# EAGLE design mac_schematic_v11print (EAGLE 8.7.0)
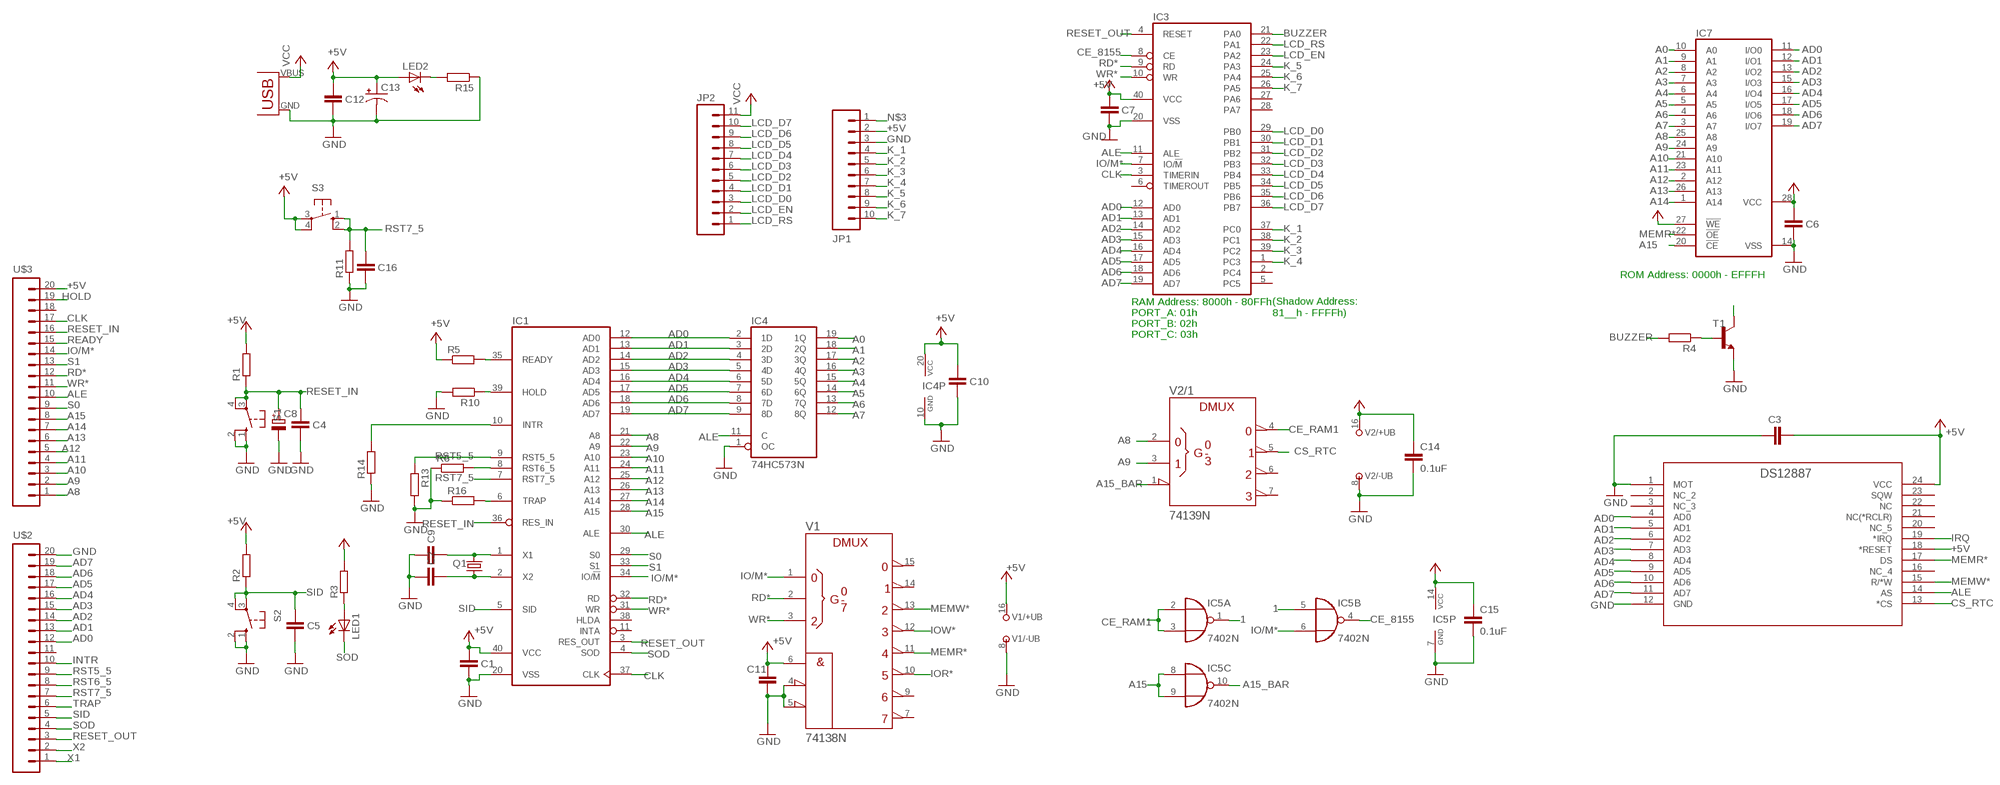
[diagram p0: schematic, sheet 1]

## Parts
C1  C-EUC0805K  [C0805K]
C2  C-EUC0805K  [C0805K]
C3  C-EUC0805K  [C0805K]
C4  C-EUC0805K  [C0805K]
C5  C-EUC0805K  [C0805K]
C6  C-EUC0805K  [C0805K]
C7  C-EUC0805K  [C0805K]
C8  CPOL-EUE2.5-5  [E2,5-5]
C9  C-EUC0805K  [C0805K]
C10  C-EUC0805K  [C0805K]
C11  C-EUC0805K  [C0805K]
C12  C-EUC0805K  [C0805K]
C13  CAP_POL_10V  [C/6032-28R]
C14  0.1uF  C-EUC0805K  [C0805K]
C15  0.1uF  C-EUC0805K  [C0805K]
C16  C-EUC0805K  [C0805K]
IC1  8085  [DIL40]
IC3  8155  [DIL40]
IC4  74HC573N  [DIL20]
IC5  7402N  [DIL14]
IC7  58C256P  [DIL28-6]
JP1  M10SILK_FEMALE_PTH  [1X10]
JP2  M11PTH  [1X11]
LED1  LED3MM  [LED3MM]
LED2  LED3MM  [LED3MM]
Q1  CRYSTALHC49U-V  [HC49U-V]
R1  R-EU_0204/7  [0204/7]
R2  R-EU_0204/7  [0204/7]
R3  R-EU_0204/7  [0204/7]
R4  R-EU_0204/7  [0204/7]
R5  R-EU_0204/7  [0204/7]
R6  R-EU_0204/7  [0204/7]
R10  R-EU_0204/7  [0204/7]
R11  R-EU_0204/7  [0204/7]
R13  R-EU_0204/7  [0204/7]
R14  R-EU_0204/7  [0204/7]
R15  R-EU_0204/7  [0204/7]
R16  R-EU_0204/7  [0204/7]
S1  40-XX  [B3F-40XX]
S2  40-XX  [B3F-40XX]
S3  40-XX  [B3F-40XX]
T1  BC547-NPN-TO92-CBE  [TO92-CBE]
U1  DS12887  [21-0241A_24]
U$1  USB(POWER)  [USB(POWER)]
U$2  M20  [LONDPAD]
U$3  M20  [LONDPAD]
V1  74138N  [DIL16]
V2  74139N  [DIL16]

## Nets
1: IC5.1(A:O) IC5.5(B:I0)
+5V: C1.1 C3.2 C6.1 C7.1 C10.1 C11.1 C12.1 C13.+ C14.1 C15.1 IC1.40(VCC) IC3.40(VCC) IC4.20(VCC) IC5.14(P:VCC) IC7.27(!WE) IC7.28(VCC) JP1.2 LED2.A R1.2 R2.2 R3.2 R5.1 S3.3(P) S3.4(P1) U1.18(*RESET) U1.24(VCC) U$3.20 V1.6(G1) V1.16(+UB) V2.16(/+UB:+UB) ; supply symbol labelled VCC
A0: IC4.19(1Q) IC7.10(A0)
A1: IC4.18(2Q) IC7.9(A1)
A2: IC4.17(3Q) IC7.8(A2)
A3: IC4.16(4Q) IC7.7(A3)
A4: IC4.15(5Q) IC7.6(A4)
A5: IC4.14(6Q) IC7.5(A5)
A6: IC4.13(7Q) IC7.4(A6)
A7: IC4.12(8Q) IC7.3(A7)
A8: IC1.21(A8) IC7.25(A8) U$3.1 V2.2(/1:A)
A9: IC1.22(A9) IC7.24(A9) U$3.2 V2.3(/1:B)
A10: IC1.23(A10) IC7.21(A10) U$3.3
A11: IC1.24(A11) IC7.23(A11) U$3.4
A12: IC1.25(A12) IC7.2(A12) U$3.5
A13: IC1.26(A13) IC7.26(A13) U$3.6
A14: IC1.27(A14) IC7.1(A14) U$3.7
A15: IC1.28(A15) IC5.8(C:I0) IC5.9(C:I1) IC7.20(!CE) U$3.8
A15_BAR: IC5.10(C:O) V2.1(/1:!G)
AD0: IC1.12(AD0) IC3.12(AD0) IC4.2(1D) IC7.11(I/O0) U1.4(AD0) U$2.12
AD1: IC1.13(AD1) IC3.13(AD1) IC4.3(2D) IC7.12(I/O1) U1.5(AD1) U$2.13
AD2: IC1.14(AD2) IC3.14(AD2) IC4.4(3D) IC7.13(I/O2) U1.6(AD2) U$2.14
AD3: IC1.15(AD3) IC3.15(AD3) IC4.5(4D) IC7.15(I/O3) U1.7(AD3) U$2.15
AD4: IC1.16(AD4) IC3.16(AD4) IC4.6(5D) IC7.16(I/O4) U1.8(AD4) U$2.16
AD5: IC1.17(AD5) IC3.17(AD5) IC4.7(6D) IC7.17(I/O5) U1.9(AD5) U$2.17
AD6: IC1.18(AD6) IC3.18(AD6) IC4.8(7D) IC7.18(I/O6) U1.10(AD6) U$2.18
AD7: IC1.19(AD7) IC3.19(AD7) IC4.9(8D) IC7.19(I/O7) U1.11(AD7) U$2.19
ALE: IC1.30(ALE) IC3.11(ALE) IC4.11(C) U1.14(AS) U$3.10
BUZZER: IC3.21(PA0) R4.2
CE_8155: IC3.8(CE) IC5.4(B:O)
CE_RAM1: IC5.2(A:I0) IC5.3(A:I1) V2.4(/1:Y0)
CLK: IC1.37(CLK) IC3.3(TIMERIN) U$3.17
CS_RTC: U1.13(*CS) V2.5(/1:Y1)
GND: C1.2 C2.1 C3.1 C4.2 C5.2 C6.2 C7.2 C8.- C9.1 C10.2 C11.2 C12.2 C13.- C14.2 C15.2 C16.2 IC1.20(VSS) IC3.20(VSS) IC4.1(OC) IC4.10(GND) IC5.7(P:GND) IC7.14(VSS) JP1.3 R6.1 R10.2 R11.1 R13.2 R14.1 R15.1 R16.1 S1.1(S) S1.2(S1) S2.1(S) S2.2(S1) T1.E U1.1(MOT) U1.12(GND) U$1.GND U$2.20 V1.4(!G2A) V1.5(!G2B) V1.8(-UB) V2.8(/-UB:-UB)
HOLD: IC1.39(HOLD) R10.1 U$3.19
INTR: IC1.10(INTR) R14.2 U$2.10
IO/M*: IC1.34(IO/!M) IC3.7(IO/!M) IC5.6(B:I1) U$3.14 V1.1(A)
IOR*: V1.10(Y5)
IOW*: V1.12(Y3)
IRQ: U1.19(*IRQ)
K_1: IC3.37(PC0) JP1.4
K_2: IC3.38(PC1) JP1.5
K_3: IC3.39(PC2) JP1.6
K_4: IC3.1(PC3) JP1.7
K_5: IC3.24(PA3) JP1.8
K_6: IC3.25(PA4) JP1.9
K_7: IC3.26(PA5) JP1.10
LCD_D0: IC3.29(PB0) JP2.3
LCD_D1: IC3.30(PB1) JP2.4
LCD_D2: IC3.31(PB2) JP2.5
LCD_D3: IC3.32(PB3) JP2.6
LCD_D4: IC3.33(PB4) JP2.7
LCD_D5: IC3.34(PB5) JP2.8
LCD_D6: IC3.35(PB6) JP2.9
LCD_D7: IC3.36(PB7) JP2.10
LCD_EN: IC3.23(PA2) JP2.2
LCD_RS: IC3.22(PA1) JP2.1
MEMR*: IC7.22(!OE) U1.17(DS) V1.11(Y4)
MEMW*: U1.15(R/*W) V1.13(Y2)
N$1: LED1.A R3.1
N$3: JP1.1 T1.C
N$4: R4.1 T1.B
N$10: LED2.K(C) R15.2
RD*: IC1.32(RD) IC3.9(RD) U$3.12 V1.2(B)
READY: IC1.35(READY) R5.2 U$3.15
RESET_IN: C4.1 C8.+ IC1.36(RES_IN) R1.1 S1.3(P) S1.4(P1) U$3.16
RESET_OUT: IC1.3(RES_OUT) IC3.4(RESET) U$2.3
RST5_5: IC1.9(RST5_5) R13.1 U$2.9
RST6_5: IC1.8(RST6_5) R6.2 U$2.8
RST7_5: C16.1 IC1.7(RST7_5) R11.2 S3.1(S) S3.2(S1) U$2.7
S0: IC1.29(S0) U$3.9
S1: IC1.33(S1) U$3.13
SID: C5.1 IC1.5(SID) R2.1 S2.3(P) S2.4(P1) U$2.5
SOD: IC1.4(SOD) LED1.K(C) U$2.4
TRAP: IC1.6(TRAP) R16.2 U$2.6
VCC: JP2.11 U$1.VBUS(VCC)
WR*: IC1.31(WR) IC3.10(WR) U$3.11 V1.3(C)
X1: C9.2 IC1.1(X1) Q1.2 U$2.1
X2: C2.2 IC1.2(X2) Q1.1 U$2.2
Unconnected: IC1.11(INTA) IC1.38(HLDA) IC3.2(PC4) IC3.5(PC5) IC3.6(TIMEROUT) IC3.27(PA6) IC3.28(PA7) IC5.11(D:I0) IC5.12(D:I1) IC5.13(D:O) U1.2(NC_2) U1.3(NC_3) U1.16(NC_4) U1.20(NC_5) U1.21(NC(*RCLR)) U1.22(NC) U1.23(SQW) U$2.11 U$3.18 V1.7(Y7) V1.9(Y6) V1.14(Y1) V1.15(Y0) V2.6(/1:Y2) V2.7(/1:Y3) V2.9(/2:Y3) V2.10(/2:Y2) V2.11(/2:Y1) V2.12(/2:Y0) V2.13(/2:B) V2.14(/2:A) V2.15(/2:!G)

## Notes on the sheet
- ROM Address: 0000h - EFFFH
- RAM Address: 8000h - 80FFh
- PORT_A: 01h
- (Shadow Address: 
  81__h - FFFFh)
- PORT_B: 02h
- PORT_C: 03h

## Library data of the parts
C1-C7 C9 C16 = rcl:C-EU: CAPACITOR, European symbol; SPICEPREFIX: C
C8 = rcl:CPOL-EU: POLARIZED CAPACITOR, European symbol
C10-C12 C14 C15 = resistor:C-EU: CAPACITOR, European symbol
C13 = CEDT_JANUARY_2015_v7:CAP_POL
IC1 = micro-intel:8085: MICROCOMPUTER/PERIPHERAL DEVICE; OC_FARNELL: unknown; OC_NEWARK: unknown
IC3 = micro-intel:8155: MICROCOMPUTER/PERIPHERAL DEVICE; OC_FARNELL: unknown; OC_NEWARK: unknown
IC4 = 74xx-eu:74*573: 8-bit D latch BUS DRIVER
IC5 = 74xx-eu:74*02: Quad 2-input NOR gate
IC7 = memory-hitachi:58C256P: MEMORY; MPN: HN58C256AP85E; OC_FARNELL: 1496447; OC_NEWARK: 61M6616
JP1 = SparkFun-Connectors:M10: Header 10 Standard 10-pin 0.1" header. Use with straight break away headers (SKU : PRT-00116), right angle break away headers (PRT-00553), swiss pins (PRT-00743), machine pins (PRT-00117), and female headers (PRT-00115).; PROD_ID: CONN-11563
JP2 = SparkFun-Connectors:M11: Header 11 Standard 11-pin 0.1" header. Use with straight break away headers (SKU : PRT-00116), right angle break away headers (PRT-00553), swiss pins (PRT-00743), machine pins (PRT-00117), and female headers (PRT-00115).
LED1 LED2 = led:LED: LED OSRAM: - CHIPLED LG R971, LG N971, LY N971, LG Q971, LY Q971, LO R971, LY R971 LH N974, LH R974 LS Q976, LO Q976, LY Q976 LO Q996 - Hyper CHIPLED LW Q18S LB Q993, LB Q99A, LB R99A - SideLED LS A670, LO A670, LY A670, LG A670, LP A670 LB A673, LV A673, LT A673, LW A673 LH A674 LY A675 LS A676, LA A676, LO A676, LY A676, LW A676 LS A679, LY A679, LG A679 - Hyper Micro SIDELED® LS Y876, LA Y876, LO Y876, LY Y876 LT Y87S - SmartLED LW L88C, LW L88S LB L89C, LB L89S, LG L890 LS L89K, LO L89K, LY L89K LS L896, LA L896, LO L896, LY L896 - TOPLED LS T670, LO T670, LY T670, LG T670, LP T670 LSG T670, LSP T670, LSY T670, LOP T670, LYG T670 LG T671, LOG T671, LSG T671 LB T673, LV T673, LT T673, LW T673 LH T674 LS T676, LA T676, LO T676, LY T676, LB T676, LH T676, LSB T676, LW T676 LB T67C, LV T67C, LT T67C, LS T67K, LO T67K, LY T67K, LW E67C LS E67B, LA E67B, LO E67B, LY E67B, LB E67C, LV E67C, LT E67C LW T67C LS T679, LY T679, LG T679 LS T770, LO T770, LY T770, LG T770, LP T770 LB T773, LV T773, LT T773, LW T773 LH T774 LS E675, LA E675, LY E675, LS T675 LS T776, LA T776, LO T776, LY T776, LB T776 LHGB T686 LT T68C, LB T68C - Hyper Mini TOPLED® LB M676 - Mini TOPLED Santana® LG M470 LS M47K, LO M47K, LY M47K Source: http://www.osram.convergy.de LUXEON: - LUMILED® LXK2-PW12-R00, LXK2-PW12-S00, LXK2-PW14-U00, LXK2-PW14-V00 LXK2-PM12-R00, LXK2-PM12-S00, LXK2-PM14-U00 LXK2-PE12-Q00, LXK2-PE12-R00, LXK2-PE12-S00, LXK2-PE14-T00, LXK2-PE14-U00 LXK2-PB12-K00, LXK2-PB12-L00, LXK2-PB12-M00, LXK2-PB14-N00, LXK2-PB14-P00, LXK2-PB14-Q00 LXK2-PR12-L00, LXK2-PR12-M00, LXK2-PR14-Q00, LXK2-PR14-R00 LXK2-PD12-Q00, LXK2-PD12-R00, LXK2-PD12-S00 LXK2-PH12-R00, LXK2-PH12-S00 LXK2-PL12-P00, LXK2-PL12-Q00, LXK2-PL12-R00 Source: www.luxeon.com KINGBRIGHT: KA-3528ASYC Source: www.kingbright.com
Q1 = crystal:CRYSTAL: CRYSTAL; OC_FARNELL: 1666969; OC_NEWARK: unknown
R1-R6 R10 R11 R13-R16 = rcl:R-EU_: RESISTOR, European symbol; SPICEPREFIX: R
S1-S3 = switch-omron:40-XX: OMRON SWITCH; MF: OMRON COMPONENTS USA; MPN: B3F-4000; OC_FARNELL: 176434; OC_NEWARK: 36K3105
T1 = transistor:*-NPN-: NPN Transistror BF959 corrected 2008.03.06
U1 = DS12887:DS12887; AVAILABILITY: Unavailable; DESCRIPTION: IC RTC CLK/CALENDAR PAR 24-EDIP; MF: Maxim Integrated; MP: DS12887; PACKAGE: DIP-24 Maxim Integrated; PRICE: 7.29 USD
U$1 = CEDT_JANUARY_2015_v7:USB(POWER)
U$2 U$3 = m20:M20
V1 = 74ttl-din:74*138: 3-line to 8-line DECODER/DEMULTIPLEXER
V2 = 74ttl-din:74*139: Dual 2-line to 4-line DECODER/DEMULTIPLEXER

## Net classes
2 GND: width 0.406 mm, clearance 0.203 mm

## Board
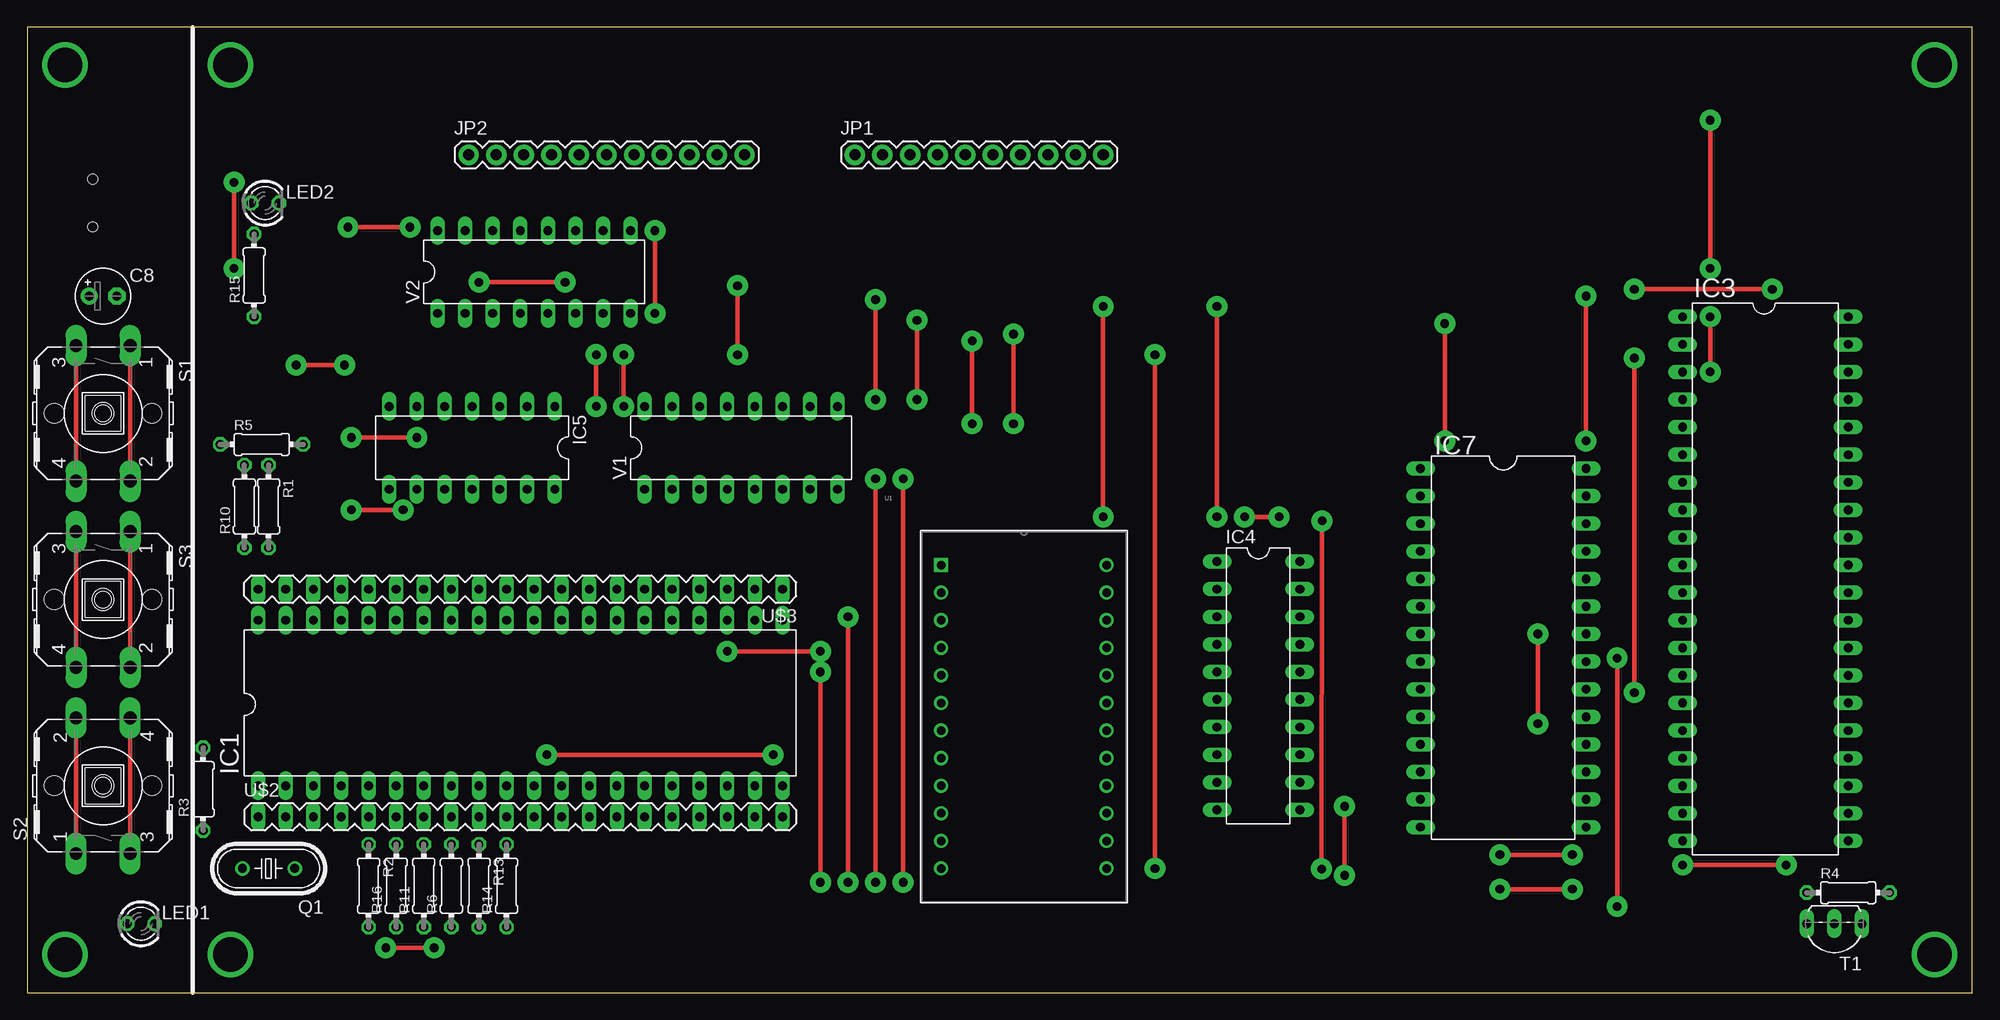
[diagram p1: board, top side]
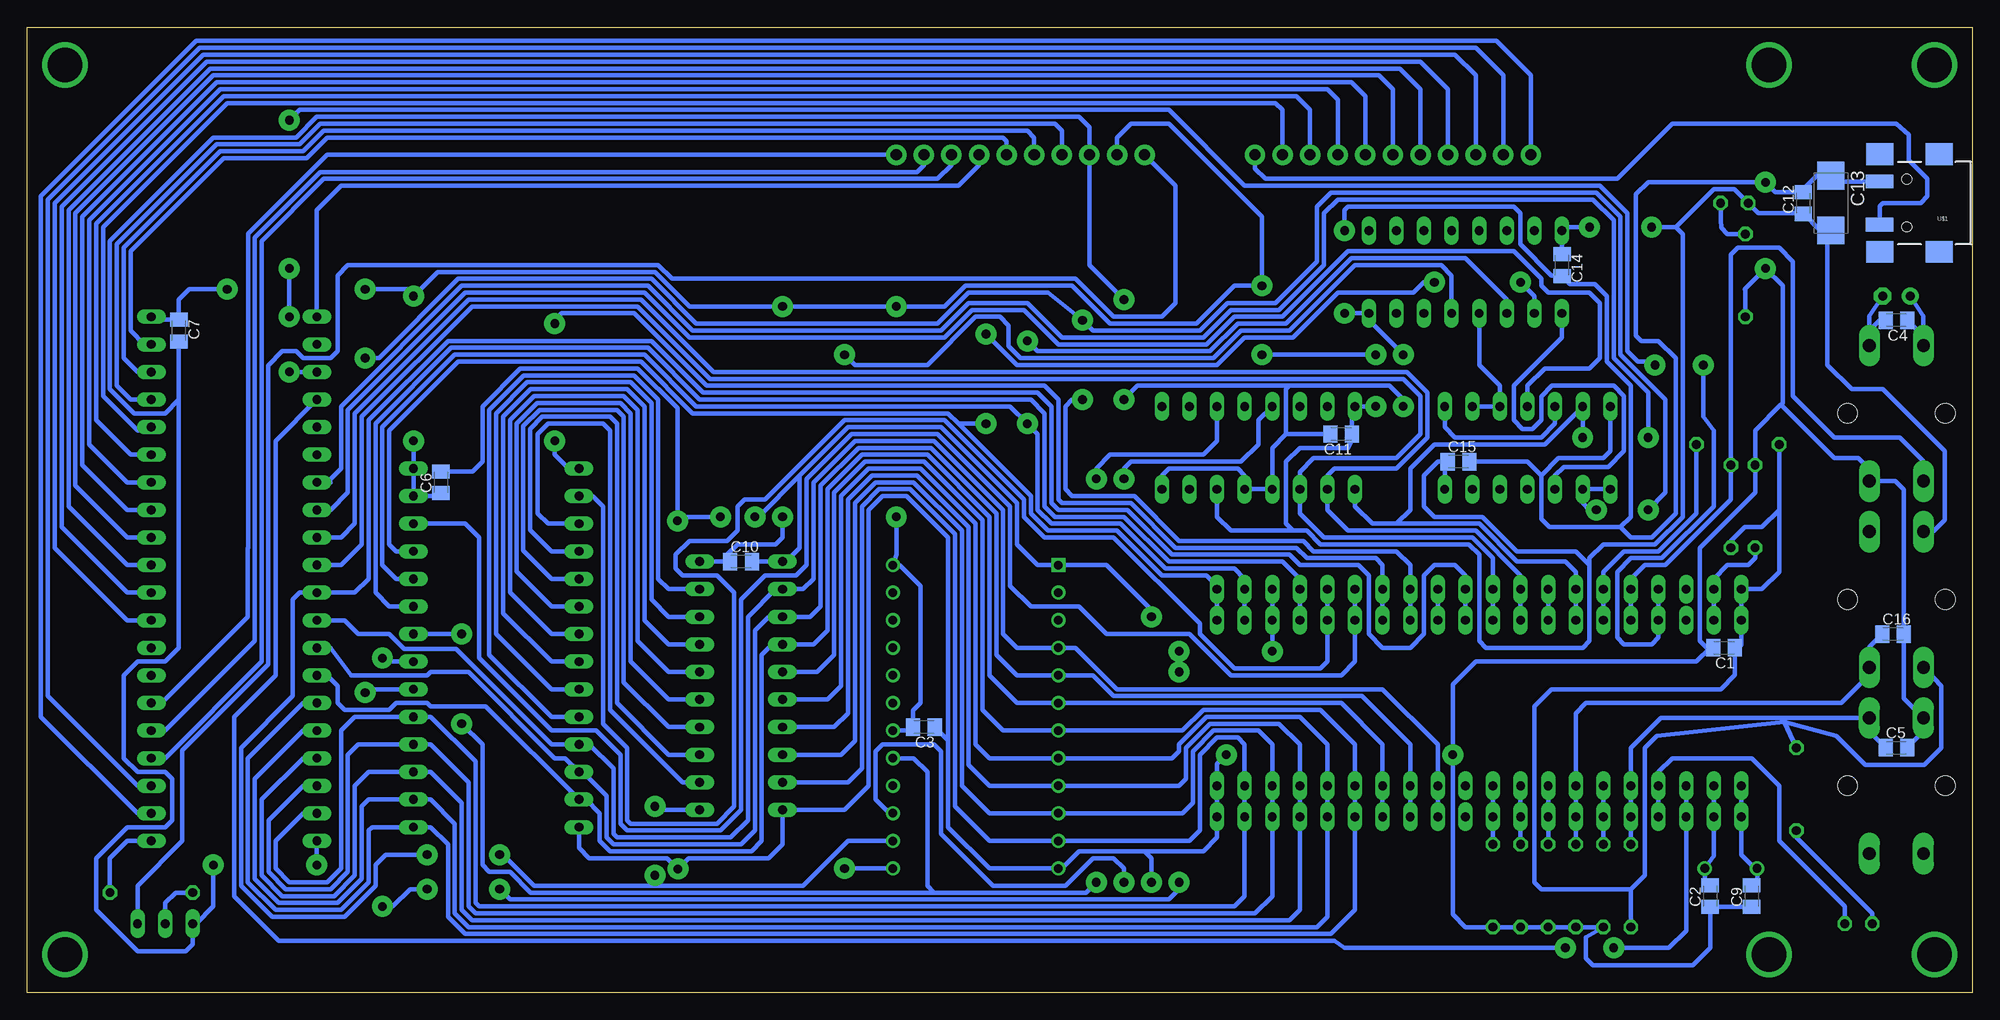
[diagram p2: board, bottom side, seen from below]

Size 179.07 x 88.9 mm. Coordinates in mm from the lower left corner, seen from the top.
Outline: 0,0 179.07,0 179.07,88.9 0,88.9 0,0
Copper layers (1*16): Top 0.035mm / dielectric 1.5mm / Bottom 0.035mm
Design rules "drcsetting *": minimum track width 16mil, minimum drill 25mil, track to track 8mil, track to pad 8mil, pad to pad 8mil, via to via 8mil, smd to smd 8mil, copper to edge 40mil, drill to drill 12mil, minimum pad ring 10mil, minimum via ring 10mil, stop-mask expansion 4mil, vias tented up to drill 0mil, thermal gap 10mil

### Footprints (pad centres in the part's own frame; a part is rotated, then mirrored left to right if it is on the bottom)
C0805K = smd 1.3 x 1.6: 1 -1,0; 2 1,0
E2,5-5 = drill 0.813 pad 1.6: + -1.27,0 | drill 0.813 pad 1.6 octagon: - 1.27,0
C/6032-28R = smd 2.55 x 2.5: + 2.525,0; - -2.525,0
DIL40 = drill 0.813 long: 1 -24.13,-7.62; 2 -21.59,-7.62; 3 -19.05,-7.62; 4 -16.51,-7.62; 5 -13.97,-7.62; 6 -11.43,-7.62; 7 -8.89,-7.62; 8 -6.35,-7.62; 9 -3.81,-7.62; 10 -1.27,-7.62; 11 1.27,-7.62; 12 3.81,-7.62; 13 6.35,-7.62; 14 8.89,-7.62; 15 11.43,-7.62; 16 13.97,-7.62; 17 16.51,-7.62; 18 19.05,-7.62; 19 21.59,-7.62; 20 24.13,-7.62; 21 24.13,7.62; 22 21.59,7.62; 23 19.05,7.62; 24 16.51,7.62; 25 13.97,7.62; 26 11.43,7.62; 27 8.89,7.62; 28 6.35,7.62; 29 3.81,7.62; 30 1.27,7.62; 31 -1.27,7.62; 32 -3.81,7.62; 33 -6.35,7.62; 34 -8.89,7.62; 35 -11.43,7.62; 36 -13.97,7.62; 37 -16.51,7.62; 38 -19.05,7.62; 39 -21.59,7.62; 40 -24.13,7.62
DIL20 = drill 0.813 long: 1 -11.43,-3.81; 2 -8.89,-3.81; 3 -6.35,-3.81; 4 -3.81,-3.81; 5 -1.27,-3.81; 6 1.27,-3.81; 7 3.81,-3.81; 8 6.35,-3.81; 9 8.89,-3.81; 10 11.43,-3.81; 11 11.43,3.81; 12 8.89,3.81; 13 6.35,3.81; 14 3.81,3.81; 15 1.27,3.81; 16 -1.27,3.81; 17 -3.81,3.81; 18 -6.35,3.81; 19 -8.89,3.81; 20 -11.43,3.81
DIL14 = drill 0.813 long: 1 -7.62,-3.81; 2 -5.08,-3.81; 3 -2.54,-3.81; 4 0,-3.81; 5 2.54,-3.81; 6 5.08,-3.81; 7 7.62,-3.81; 8 7.62,3.81; 9 5.08,3.81; 10 2.54,3.81; 11 0,3.81; 12 -2.54,3.81; 13 -5.08,3.81; 14 -7.62,3.81
DIL28-6 = drill 0.813 long: 1 -16.51,-7.62; 2 -13.97,-7.62; 3 -11.43,-7.62; 4 -8.89,-7.62; 5 -6.35,-7.62; 6 -3.81,-7.62; 7 -1.27,-7.62; 8 1.27,-7.62; 9 3.81,-7.62; 10 6.35,-7.62; 11 8.89,-7.62; 12 11.43,-7.62; 13 13.97,-7.62; 14 16.51,-7.62; 15 16.51,7.62; 16 13.97,7.62; 17 11.43,7.62; 18 8.89,7.62; 19 6.35,7.62; 20 3.81,7.62; 21 1.27,7.62; 22 -1.27,7.62; 23 -3.81,7.62; 24 -6.35,7.62; 25 -8.89,7.62; 26 -11.43,7.62; 27 -13.97,7.62; 28 -16.51,7.62
1X10 = drill 1.016 pad 1.88: 1 0,0; 2 2.54,0; 3 5.08,0; 4 7.62,0; 5 10.16,0; 6 12.7,0; 7 15.24,0; 8 17.78,0; 9 20.32,0; 10 22.86,0
1X11 = drill 1.016 pad 1.88: 1 0,0; 2 2.54,0; 3 5.08,0; 4 7.62,0; 5 10.16,0; 6 12.7,0; 7 15.24,0; 8 17.78,0; 9 20.32,0; 10 22.86,0; 11 25.4,0
LED3MM = drill 0.813 octagon: A -1.27,0; K 1.27,0
HC49U-V = drill 0.813: 1 -2.413,0; 2 2.413,0
0204/7 = drill 0.813 octagon: 1 -3.81,0; 2 3.81,0
B3F-40XX = drill 1.194 long: 1 -6.248,2.489; 2 6.248,2.489; 3 -6.248,-2.489; 4 6.248,-2.489 | hole 1.803: 0,-4.496; 0,4.496
TO92-CBE = drill 0.813 long: B 0,0; C -2.54,0; E 2.54,0
21-0241A_24 = drill 0.787 pad 1.295 square: 1 -15.24,27.94 | drill 0.787 pad 1.295: 2 -15.24,25.4; 3 -15.24,22.86; 4 -15.24,20.32; 5 -15.24,17.78; 6 -15.24,15.24; 7 -15.24,12.7; 8 -15.24,10.16; 9 -15.24,7.62; 10 -15.24,5.08; 11 -15.24,2.54; 12 -15.24,0; 13 0,0; 14 0,2.54; 15 0,5.08; 16 0,7.62; 17 0,10.16; 18 0,12.7; 19 0,15.24; 20 0,17.78; 21 0,20.32; 22 0,22.86; 23 0,25.4; 24 0,27.94
USB(POWER) = smd 2.54 x 1.27: GND 2.5,-1.981; VBUS 2.5,1.981 | smd 2.5 x 2: GND@1 -3,-4.5; GND@2 -3,4.5; GND@3 2.5,4.5; GND@4 2.5,-4.5 | hole 0.9: 0,2.2; 0,-2.2
LONDPAD = drill 0.813 long: 1 1.27,3.81; 2 3.81,3.81; 3 6.35,3.81; 4 8.89,3.81; 5 11.43,3.81; 6 13.97,3.81; 7 16.51,3.81; 8 19.05,3.81; 9 21.59,3.81; 10 24.13,3.81; 11 26.67,3.81; 12 29.21,3.81; 13 31.75,3.81; 14 34.29,3.81; 15 36.83,3.81; 16 39.37,3.81; 17 41.91,3.81; 18 44.45,3.81; 19 46.99,3.81; 20 49.53,3.81
DIL16 = drill 0.813 long: 1 -8.89,-3.81; 2 -6.35,-3.81; 3 -3.81,-3.81; 4 -1.27,-3.81; 5 1.27,-3.81; 6 3.81,-3.81; 7 6.35,-3.81; 8 8.89,-3.81; 9 8.89,3.81; 10 6.35,3.81; 11 3.81,3.81; 12 1.27,3.81; 13 -1.27,3.81; 14 -3.81,3.81; 15 -6.35,3.81; 16 -8.89,3.81

### Placement (x,y rotation side)
C1  22.86,31.75 180 bottom
C2  24.13,8.89 90 bottom
C3  96.52,24.45 180 bottom
C4  6.99,61.91 180 bottom
C5  6.99,22.54 0 bottom
C6  140.97,46.99 90 bottom
C7  165.1,60.96 270 bottom
C8  6.99,64.14 0 top
C9  20.32,8.89 90 bottom
C10  113.35,39.69 0 bottom
C11  58.1,51.44 180 bottom
C12  15.56,72.71 90 bottom
C13  13.02,72.71 270 bottom
C14  37.78,66.99 270 bottom
C15  47.31,48.9 0 bottom
C16  7.3,33.02 0 bottom
IC1  45.4,26.67 0 top
IC3  160.02,38.1 270 top
IC4  113.35,28.26 270 top
IC5  40.96,50.16 180 top
IC7  135.89,31.75 270 top
JP1  76.2,77.15 0 top
JP2  40.64,77.15 0 top
LED1  10.48,6.35 0 top
LED2  21.91,72.71 0 top
Q1  22.23,11.43 180 top
R1  22.23,44.77 270 top
R2  31.43,9.84 270 top
R3  16.19,18.73 90 top
R4  167.64,9.21 0 top
R5  21.59,50.48 0 top
R6  39.05,9.84 90 top
R10  20,44.77 90 top
R11  36.51,9.84 90 top
R13  41.59,9.84 270 top
R14  44.13,9.84 90 top
R15  20.89,66.04 90 top
R16  33.97,9.84 90 top
S1  6.99,53.34 270 top
S2  6.99,19.05 90 top
S3  6.99,36.2 270 top
T1  166.37,6.35 180 top
U1  99.38,11.43 0 top
U$1  6.03,72.71 180 bottom
U$2  20,12.38 0 top
U$3  70.8,40.96 180 top
V1  65.72,50.16 0 top
V2  46.67,66.36 0 top

### Tracks (layer width: path | path; a pad name or v marks a point on that pad's centre or on a via)
1
  Bottom 0.406: IC5.5 38.42,52.39 39.69,51.12 47.62,51.12 48.58,52.07 IC5.1
+5V  (via drill 0.8 pad 1.93)
  Top 0.406: v99.06,43.81 v99.06,63.18 | v54.93,58.74 v54.93,53.98 | v29.53,70.48 v35.24,70.48 | S3.4 S3.3 | v143.51,50.8 v143.51,64.14 | v147.96,64.77 v160.66,64.77 | v109.54,43.81 v109.54,63.18 | v65.41,58.74 v65.41,65.09
  Bottom 0.406: 12.47,70.73 C13.+ | IC4.20 C10.1 114.62,39.96 114.62,40.32 113.67,41.27 110.17,41.27 109.54,41.91 v109.54,43.81 | 21.27,37.1 IC1.40 | 15.56,71.75 C12.1 | 15.56,71.75 19.68,71.75 LED2.A 21.91,73.98 23.81,73.98 27.3,70.48 | C13.+ 13.98,70.18 15.56,71.75 | IC1.40 U$3.20 19.37,37.15 17.78,38.73 17.78,44.45 | C15.1 48.58,48.62 IC5.14 | 37.78,67.9 C14.1 V2.16 | C13.+ 13.34,69.86 13.34,57.78 11.11,55.56 8.26,55.56 2.54,49.85 2.54,43.5 3.59,42.44 S3.3 | 37.94,70.17 V2.16 | 4.45,30 S3.4 3.17,28.63 3.17,28.57 2.86,28.26 2.86,22.54 4.45,20.95 9.84,20.95 12.54,23.65 17.3,24.92 | 48.74,48.74 C15.1 | v99.06,43.81 99.06,40.32 U1.24 98.74,39.37 96.84,37.47 96.84,26.67 97.52,25.99 C3.2 97.84,24.13 U1.18 | IC3.40 167.37,61.96 C7.1 165.1,63.82 164.15,64.77 v160.66,64.77 | 48.26,48.9 C15.1 | 35.24,39.37 36.51,40.64 41.91,40.64 45.09,43.81 49.53,43.81 50.48,44.77 50.48,47.62 49.21,48.9 C15.1 | 35.24,39.37 35.24,32.38 35.88,31.75 44.77,31.75 45.4,32.38 45.4,40.32 46.35,41.27 60.01,41.27 61.28,42.55 62.55,42.55 | 21.86,31.16 21.86,31.43 | 21.86,31.43 C1.1 21.86,29.26 23.18,27.94 38.73,27.94 40.32,26.35 40.32,10.16 39.69,9.53 31.43,9.53 | 21.86,31.43 21.27,32.02 IC1.40 | V1.6 69.53,43.81 68.26,42.55 62.55,42.55 | 62.55,42.55 63.18,43.18 63.18,48.9 61.91,50.16 57.47,50.16 57.15,50.8 57.1,51.07 C11.1 57.1,53.7 V1.16 v54.93,53.98 | 35.24,39.37 35.24,40.01 33.97,41.27 29.21,41.27 26.67,43.81 26.67,69.85 27.3,70.48 | v35.24,70.48 37.47,70.48 V2.16 | C6.1 141.24,45.72 IC7.27 IC7.28 v143.51,50.8 | 28.57,70.48 v29.53,70.48 27.3,70.48 | R5.1 17.78,44.45 | R1.2 22.23,41.59 20.95,42.86 19.37,42.86 17.78,44.45
  Bottom 0.406: v54.93,58.74 v65.41,58.74 | JP1.2 78.74,78.74 77.47,80.01 73.98,80.01 65.41,71.44 v65.41,65.09 67.94,65.09 71.44,61.59 79.38,61.59 82.87,65.09 92.71,65.09 94.61,63.18 v99.06,63.18 v109.54,63.18 118.11,63.18 121.28,66.36 141.29,66.36 v143.51,64.14 144.15,64.77 v147.96,64.77 | 31.43,9.53 R2.2 | 17.3,24.92 29.05,23.65 30.16,22.54 30.16,10.79 31.43,9.53 | R3.2 17.3,24.92
A0
  Bottom 0.406: IC7.10 130.81,25.4 136.53,31.11 136.53,53.66 133.35,56.83 123.19,56.83 120.97,54.61 120.97,38.1 120.02,37.15 IC4.19
A1
  Bottom 0.406: IC7.9 130.81,27.94 135.89,33.02 135.89,53.34 133.03,56.2 123.51,56.2 121.6,54.29 121.6,36.2 120.02,34.61 IC4.18
A2
  Bottom 0.406: IC7.8 130.81,30.48 135.25,34.92 135.25,53.02 132.72,55.56 123.83,55.56 122.24,53.98 122.24,34.29 120.02,32.07 IC4.17
A3
  Bottom 0.406: IC7.7 130.81,33.02 134.62,36.83 134.62,52.7 132.4,54.93 124.14,54.93 122.87,53.66 122.87,32.38 120.02,29.53 IC4.16
A4
  Bottom 0.406: IC7.6 130.81,35.56 134.01,38.76 134.01,52.41 132.13,54.29 124.46,54.29 123.51,53.34 123.51,30.48 120.02,26.99 IC4.15
A5
  Bottom 0.406: IC7.5 130.81,38.1 133.4,40.69 133.4,52.16 131.9,53.66 124.78,53.66 124.14,53.02 124.14,28.57 120.02,24.45 IC4.14
A6
  Bottom 0.406: IC7.4 130.81,40.64 132.79,42.62 132.79,51.9 131.67,53.02 125.41,53.02 124.78,52.39 124.78,26.67 120.02,21.91 IC4.13
A7
  Bottom 0.406: IC4.12 118.75,19.37 125.41,26.04 125.41,51.75 126.05,52.39 131.13,52.39 132.08,51.44 132.08,44.13 131.13,43.18 IC7.3
A8  (via drill 0.8 pad 1.93)
  Top 0.406: v41.59,65.41 v49.53,65.41 | v90.81,60.64 v90.81,52.39
  Bottom 0.406: IC1.21 U$3.1 69.53,37.47 70.48,38.42 74.61,38.42 78.74,42.55 85.09,42.55 86.68,44.13 86.68,45.72 93.34,52.39 | V2.2 40.32,64.14 v41.59,65.41 | v49.53,65.41 50.48,65.41 51.44,64.45 58.42,64.45 62.55,60.33 66.99,60.33 69.53,57.78 87.95,57.78 v90.81,60.64 | IC7.25 145.1,40.64 145.73,41.27 145.73,51.75 139.38,58.1 122.56,58.1 117.79,53.34 94.3,53.34 93.34,52.39 | v90.81,52.39 93.34,52.39
A9  (via drill 0.8 pad 1.93)
  Top 0.406: v87,60.01 v87,52.39
  Bottom 0.406: IC1.22 U$3.2 66.99,38.1 67.94,39.05 74.3,39.05 78.42,43.18 84.77,43.18 86.04,44.45 86.04,51.44 v87,52.39 88.58,53.98 117.47,53.98 122.24,58.74 139.7,58.74 146.37,52.07 146.37,39.37 145.1,38.1 IC7.24 | V2.3 42.86,63.82 46.67,67.63 57.15,67.63 63.18,61.59 67.63,61.59 70.17,59.05 86.04,59.05 v87,60.01
A10  (via drill 0.8 pad 1.93)
  Top 0.406: v64.45,31.43 v73.03,31.43 | v73.03,29.53 v73.03,10.16 | v135.57,9.53 v142.24,9.53 | v146.37,7.94 v146.37,30.8
  Bottom 0.406: U$3.3 IC1.23 v64.45,31.43 | v73.03,31.43 v73.03,29.53 | v73.03,10.16 73.03,9.53 73.98,8.57 134.62,8.57 v135.57,9.53 | v142.24,9.53 143.83,9.53 145.41,7.94 v146.37,7.94 | IC7.21 145.73,30.48 v146.37,30.8
A11
  Bottom 0.406: IC7.23 145.73,35.56 147,36.83 147,52.39 140.02,59.37 121.92,59.37 117.16,54.61 86.68,54.61 85.41,53.34 85.41,44.77 84.45,43.81 78.11,43.81 73.98,39.69 63.5,39.69 61.91,38.1 U$3.4 IC1.24
A12
  Bottom 0.406: U$3.5 IC1.25 59.37,30.48 60.01,29.84 67.94,29.84 71.12,33.02 71.12,33.97 79.06,41.91 85.41,41.91 87.31,43.81 87.31,45.4 94.61,52.7 103.82,52.7 111.12,45.4 113.03,45.4 113.67,44.77 113.67,42.55 114.62,41.59 118.11,41.59 119.38,40.32 119.38,39.05 118.75,38.42 115.57,38.42 113.98,36.83 113.98,17.14 115.57,15.56 123.51,15.56 123.83,15.88 123.83,22.54 126.05,24.77 126.05,44.77 127,45.72 IC7.2
A13
  Bottom 0.406: U$3.6 IC1.26 56.83,30.48 58.1,29.21 68.26,29.21 72.07,33.02 79.69,33.02 82.23,35.56 86.68,35.56 88.58,37.47 88.58,44.77 95.25,51.44 103.19,51.44 107.31,47.31 107.31,39.37 108.27,38.42 111.12,38.42 113.35,36.2 113.35,16.83 115.25,14.92 123.83,14.92 124.46,15.56 124.46,21.91 126.68,24.13 130.81,24.13 137.48,30.8 137.48,41.91 138.75,43.18 IC7.26
A14  (via drill 0.8 pad 1.93)
  Top 0.406: v130.49,61.59 v130.49,50.8
  Bottom 0.406: IC1.27 U$3.7 54.29,39.37 54.93,40.01 61.28,40.01 62.23,40.96 73.34,40.96 77.47,45.09 83.82,45.09 84.14,45.4 84.14,54.61 85.41,55.88 116.52,55.88 123.19,62.55 129.86,62.55 130.49,61.91 v130.49,61.59 | IC7.1 129.22,48.26 130.49,49.53 v130.49,50.8
A15  (via drill 0.8 pad 1.93)
  Top 0.406: v34.61,44.45 v29.84,44.45 | v81.92,61.91 v81.92,54.61 | v147.96,58.42 v147.96,27.62
  Bottom 0.406: IC5.8 IC5.9 35.88,45.09 35.24,44.45 v34.61,44.45 | IC1.28 U$3.8 51.75,39.37 53.02,40.64 60.64,40.64 61.59,41.59 73.03,41.59 77.15,45.72 82.87,45.72 83.5,46.35 83.5,53.98 82.87,54.61 v81.92,54.61 | v29.84,44.45 28.26,46.04 28.26,54.61 32.38,58.74 32.38,71.44 34.61,73.66 59.05,73.66 60.33,72.39 60.33,67.31 64.14,63.5 68.58,63.5 71.12,60.96 80.96,60.96 v81.92,61.91 85.09,64.45 92.39,64.45 95.25,61.59 117.47,61.59 121.6,65.72 139.38,65.72 146.69,58.42 v147.96,58.42 | 143.83,27.94 IC7.20 147.64,27.94 v147.96,27.62
A15_BAR
  Bottom 0.406: IC5.10 38.42,47.62 37.62,48.42 33.5,48.42 32.07,49.85 32.07,54.93 33.02,55.88 38.7,55.88 39.69,54.89 39.69,52.7 40.48,51.91 41.43,51.91 42.23,52.7 42.23,55.88 37.78,60.33 V2.1
AD0
  Bottom 0.406: 108.58,37.15 IC4.2 | IC4.2 110.17,37.15 112.71,34.61 112.71,15.88 114.3,14.29 124.78,14.29 125.09,14.61 125.09,20.64 127.32,22.86 IC7.11 130.81,22.86 139.6,31.65 144.36,31.65 145.73,33.02 148.59,33.02 149.86,34.29 IC3.12 | U$2.12 IC1.12 49.21,22.86 54.29,27.94 78.74,27.94 82.55,31.75 U1.4 87.95,31.75 89.22,33.02 89.22,44.45 95.57,50.8 102.87,50.8 106.68,46.99 106.68,38.1 107.63,37.15 IC4.2
AD1
  Bottom 0.406: IC3.13 151.13,31.75 149.22,29.21 142.24,29.21 141.92,29.53 138.43,29.53 130.49,21.59 129.54,21.59 IC7.12 127.95,20.32 125.73,18.1 125.73,14.29 125.09,13.65 113.35,13.65 112.08,14.92 112.08,33.34 110.81,34.61 IC4.3 107,34.61 106.05,35.56 106.05,46.67 102.55,50.16 95.89,50.16 89.85,44.13 89.85,31.11 87.95,29.21 U1.5 80.96,29.21 79.06,27.3 56.2,27.3 51.75,22.86 IC1.13 U$2.13
AD2
  Bottom 0.406: U$2.14 IC1.14 54.29,22.86 58.1,26.67 U1.6 87.95,26.67 90.49,29.21 90.49,43.81 96.2,49.53 102.23,49.53 105.41,46.35 105.41,33.34 106.68,32.07 IC4.4 110.49,32.07 111.44,31.11 111.44,13.97 112.39,13.02 125.41,13.02 126.36,13.97 126.36,16.51 127.64,17.78 IC7.13 136.84,26.35 141.92,26.35 142.24,26.67 145.1,26.67 145.73,26.04 149.86,26.04 150.5,26.67 150.5,28.26 151.45,29.21 IC3.14
AD3
  Bottom 0.406: IC3.15 153.67,26.67 158.75,21.59 158.75,10.16 156.21,7.62 150.18,7.62 147.64,10.16 147.64,14.92 147.32,15.24 IC7.15 141.92,15.24 140.34,13.65 140.34,6.99 138.75,5.4 59.05,5.4 56.83,7.62 U$2.15 IC1.15 56.83,22.86 60.01,26.04 70.8,26.04 72.71,24.13 U1.7 89.22,24.13 91.12,26.04 91.12,43.5 96.52,48.9 101.92,48.9 104.78,46.04 104.78,31.11 106.36,29.53 IC4.5
AD4
  Bottom 0.406: IC3.16 153.67,24.13 158.12,19.68 158.12,10.48 155.89,8.26 150.5,8.26 148.27,10.48 148.27,17.14 147.64,17.78 IC7.16 141.92,17.78 139.7,15.56 139.7,7.3 138.43,6.03 60.33,6.03 59.37,6.99 U$2.16 IC1.16 59.37,22.86 61.91,25.4 70.48,25.4 73.03,22.86 73.03,22.23 73.66,21.59 U1.8 90.49,21.59 91.76,22.86 91.76,43.18 96.84,48.26 101.6,48.26 104.14,45.72 104.14,28.26 105.41,26.99 IC4.6
AD5
  Bottom 0.406: IC3.17 153.67,21.59 157.48,17.78 157.48,10.79 155.57,8.89 150.81,8.89 148.91,10.79 148.91,19.05 147.64,20.32 IC7.17 141.92,20.32 139.06,17.46 139.06,7.62 138.11,6.67 62.87,6.67 61.91,7.62 U$2.17 IC1.17 61.91,22.86 63.82,24.77 70.17,24.77 72.39,22.54 72.39,19.68 73.03,19.05 U1.9 | 82.55,19.05 U1.9 | IC4.7 104.78,24.45 103.5,25.72 103.5,45.4 101.28,47.62 97.16,47.62 92.39,42.86 92.39,20.95 90.49,19.05 U1.9
AD6
  Bottom 0.406: IC3.18 153.67,19.05 156.84,15.88 156.84,11.11 155.26,9.53 151.13,9.53 149.54,11.11 149.54,21.91 148.59,22.86 IC7.18 141.92,22.86 138.43,19.37 138.43,7.94 137.79,7.3 66.04,7.3 64.45,8.89 U$2.18 IC1.18 64.45,22.86 65.72,24.13 69.85,24.13 71.75,22.23 71.75,17.46 | 81.92,16.51 U1.10 | U1.10 72.71,16.51 71.75,17.46 | 71.75,17.46 71.73,17.49 | U1.10 90.49,16.51 93.03,19.05 93.03,42.55 97.47,46.99 100.97,46.99 102.87,45.09 102.87,23.18 104.14,21.91 IC4.8
AD7
  Bottom 0.406: IC3.19 153.67,16.51 156.21,13.97 156.21,11.43 154.94,10.16 151.45,10.16 150.18,11.43 150.18,24.13 148.91,25.4 IC7.19 141.92,25.4 137.79,21.27 137.79,8.26 137.48,7.94 67.94,7.94 66.99,8.89 U$2.19 IC1.19 66.99,22.86 67.63,23.5 69.53,23.5 71.12,21.91 71.12,14.92 72.07,13.97 U1.11 90.49,13.97 93.66,17.14 93.66,42.23 97.79,46.35 100.65,46.35 102.23,44.77 102.23,20.64 103.5,19.37 IC4.9
ALE  (via drill 0.8 pad 1.93)
  Top 0.406: v135.57,12.7 v142.24,12.7 | v121.28,17.14 v121.28,10.79
  Bottom 0.406: IC1.30 U$3.10 46.67,38.42 47.62,39.37 49.53,39.37 50.48,38.42 50.48,33.02 51.75,31.75 54.29,31.75 55.56,33.02 55.56,38.42 56.52,39.37 61.91,39.37 62.87,40.32 73.66,40.32 77.79,44.45 84.14,44.45 84.77,45.09 84.77,53.98 86.04,55.24 116.84,55.24 121.6,60.01 140.34,60.01 147.64,52.7 147.64,38.1 148.91,36.83 IC3.11 153.99,36.83 154.62,36.2 154.62,27.3 159.38,22.54 159.38,9.84 156.53,6.99 149.86,6.99 147,9.84 147,11.75 146.05,12.7 v142.24,12.7 | 120.65,9.84 132.4,9.84 135.25,12.7 v135.57,12.7 | v121.28,10.79 120.65,9.84 | IC4.11 120.97,16.83 v121.28,17.14 | U1.14 103.5,13.97 107.63,9.84 120.65,9.84
BUZZER
  Bottom 0.406: IC3.21 169.86,13.97 171.45,12.38 R4.2
CE_8155
  Bottom 0.406: IC3.8 151.13,44.45 149.54,46.04 149.54,53.66 138.75,64.45 122.24,64.45 118.11,60.33 94.61,60.33 92.08,62.87 87.31,62.87 84.14,59.69 70.48,59.69 67.94,62.23 63.5,62.23 57.47,68.26 42.23,68.26 39.69,65.72 39.69,65.09 39.05,64.45 35.24,64.45 34.29,63.5 34.29,58.42 35.24,57.47 39.37,57.47 40.96,55.88 IC5.4
CE_RAM1
  Bottom 0.406: IC5.2 IC5.3 43.5,55.88 45.4,57.78 V2.4
CLK  (via drill 0.8 pad 1.93)
  Top 0.406: v24.77,57.78 v29.21,57.78 | v154.94,57.15 v154.94,62.23 | v154.94,66.67 v154.94,80.33
  Bottom 0.406: IC1.37 U$3.17 | IC1.37 28.89,36.51 | v24.77,57.78 24.77,53.02 23.81,51.75 23.81,44.77 28.57,40.01 31.43,40.01 32.7,38.73 32.7,32.7 32.07,32.07 29.53,32.07 28.89,32.7 IC1.37 | v29.21,57.78 29.53,58.1 30.8,58.1 31.75,59.05 31.75,71.75 34.29,74.3 66.99,74.3 73.98,81.28 153.99,81.28 v154.94,80.33 | v154.94,57.15 IC3.3 | v154.94,62.23 v154.94,66.67
CS_RTC  (via drill 0.8 pad 1.93)
  Top 0.406: v103.82,11.43 v103.82,58.74
  Bottom 0.406: V2.5 47.94,66.04 48.9,66.99 56.83,66.99 62.87,60.96 67.31,60.96 69.85,58.42 87.63,58.42 88.74,59.53 88.74,61.44 89.53,62.23 91.76,62.23 96.2,57.78 102.87,57.78 v103.82,58.74 | U1.13 v103.82,11.43
GND  (via drill 0.8 pad 1.93)
  Top 0.406: v119.22,43.45 v119.16,11.38 | v115.25,43.81 v112.08,43.81 | v47.84,21.91 v68.68,21.91 | v152.4,11.75 v161.93,11.75 | v75.56,34.61 v75.56,10.16 | v19.05,66.67 v19.05,74.61 | v52.39,58.74 v52.39,53.98 | S1.1 S1.2 | S2.1 4.5,24.08 4.45,24.13 4.45,25.25 S2.2 | v78.11,54.61 v78.11,63.82 | v57.78,70.17 v57.78,62.55
  Bottom 0.406: U$1.GND 12.47,74.69 C13.- 14.3,75.23 15.56,73.98 C12.2 18.14,73.71 v19.05,74.61 29.84,74.61 30.96,73.5 30.96,60.48 30.48,60.01 28.89,60.01 27.3,58.42 27.3,44.13 29.53,41.91 31.43,41.91 32.38,42.86 | C10.2 IC4.1 109.22,39.69 107.95,40.96 107.95,47.62 | 5.71,22.23 C5.2 5.99,22.59 4.45,24.13 4.45,25.25 S2.2 6.3,27.11 C16.2 6.3,46.31 7.09,47.09 S1.2 | 9.53,47.94 S1.2 | v68.68,21.91 69.53,21.06 IC1.20 U$2.20 69.53,14.29 70.8,13.02 76.2,13.02 | 39.69,47.62 40.96,48.9 C15.2 | 4.6,12.7 S2.1 | C14.2 37.83,65.93 | 165.1,54.61 166.37,53.34 169.23,53.34 171.45,55.56 171.45,69.22 161.93,78.74 154.31,78.74 152.4,80.64 82.23,80.64 81.28,79.69 JP1.3 81.28,66.99 v78.11,63.82 | 165.1,54.61 C7.2 | IC3.20 v152.4,11.75 | 76.2,13.02 82.23,13.02 83.82,11.43 U1.12 90.49,11.43 94.3,15.24 94.3,23.23 | 76.2,13.02 75.56,12.38 v75.56,10.16 | v75.56,34.61 75.56,35.24 79.69,39.37 U1.1 86.04,39.37 87.95,41.27 87.95,45.09 94.93,52.07 103.5,52.07 107.95,47.62 | IC5.7 33.34,49.85 33.97,49.21 38.1,49.21 39.69,47.62 | V2.8 56.52,62.55 | 39.69,47.62 39.69,43.62 38.92,42.86 32.38,42.86 | C11.2 63.18,51.44 | 63.18,51.44 64.45,50.16 V1.4 V1.5 66.99,47.62 67.63,48.26 73.98,48.26 74.61,47.62 V1.8 | 62.87,55.88 63.18,55.56 63.18,51.44 | 62.87,55.88 53.66,55.88 52.39,54.61 v52.39,53.98 | 94.3,23.23 94.3,41.91 98.11,45.72 100.33,45.72 101.6,44.45 101.6,19.05 103.82,16.83 IC4.10 109.54,13.65 110.81,12.38 118.16,12.38 v119.16,11.38 120.17,12.38 127.32,12.38 128.27,13.34 IC7.14 | C3.1 94.3,23.23 | 62.87,55.88 76.83,55.88 v78.11,54.61 | 32.38,42.86 31.43,43.81 31.43,55.88 33.66,58.1 33.66,64.14 34.77,65.25 37.04,65.25 C14.2
  Bottom 0.406: C14.2 37.83,66.04 38.73,66.04 41.59,68.9 41.59,71.75 42.23,72.39 57.47,72.39 57.78,72.07 v57.78,70.17 | v57.78,62.55 V2.8 | 165.1,54.61 165.1,31.75 166.37,30.48 168.91,30.48 170.18,29.21 170.18,21.59 168.91,20.32 166.37,20.32 165.74,19.68 165.74,15.88 166.37,15.24 169.86,15.24 172.72,12.38 172.72,7.62 168.91,3.81 164.47,3.81 163.83,4.45 T1.E 163.51,6.35 161.93,7.94 v161.93,11.75 | 107.95,47.62 111.76,43.81 v112.08,43.81 | C6.2 138.06,47.99 137.16,48.9 137.16,53.98 133.67,57.47 122.87,57.47 119.22,53.81 v119.22,43.45 118.85,43.81 v115.25,43.81 | v52.39,58.74 55.56,61.91 V2.8 | 17.62,54.13 20,51.75 R10.2 20,46.04 25.08,40.96 25.08,32.38 24.45,31.75 C1.2 24.13,31.75 25.4,30.48 45.72,30.48 47.84,28.36 v47.84,21.91 47.84,7.2 46.67,6.03 R14.1 R13.2 R6.1 R11.1 R16.1 35.56,5.08 35.56,3.17 34.92,2.54 25.72,2.54 24.13,4.13 C2.1 C9.1 | 17.62,54.13 17.46,54.29 17.46,65.09 v19.05,66.67 20.95,64.77 20.89,64.71 R15.1 | S1.2 9.47,48.36 | S1.2 9.47,48.21 10.48,49.21 12.7,49.21 17.62,54.13 | C8.- 9.47,62.28 9.47,60.96 | 9.47,60.96 S1.1 | C4.2 8.52,61.91 9.47,60.96
HOLD
  Bottom 0.406: IC1.39 U$3.19 23.81,38.1 22.54,39.37 20.64,39.37 20,40.01 R10.1
INTR
  Bottom 0.406: IC1.10 U$2.10 R14.2
IO/M*  (via drill 0.8 pad 1.93)
  Top 0.406: v35.88,51.12 v29.84,51.12
  Bottom 0.406: IC3.7 151.45,46.99 | 151.45,46.99 151.13,46.99 | IC1.34 U$3.14 36.51,38.73 37.47,39.69 41.91,39.69 45.4,43.18 53.02,43.18 | v35.88,51.12 IC5.6 39.37,50.48 49.53,50.48 51.75,48.26 51.75,44.45 53.02,43.18 | v29.84,51.12 29.84,55.24 33.02,58.42 33.02,71.12 34.92,73.03 58.42,73.03 59.69,71.75 59.69,66.99 63.82,62.87 68.26,62.87 70.8,60.33 83.82,60.33 87,63.5 92.39,63.5 94.93,60.96 117.79,60.96 121.92,65.09 139.06,65.09 150.18,53.98 150.18,48.26 151.45,46.99 | V1.1 56.83,44.77 55.24,43.18 53.02,43.18
K_1
  Bottom 0.406: IC3.37 169.54,54.61 170.81,55.88 170.81,68.9 161.61,78.11 153.99,78.11 152.08,80.01 84.45,80.01 83.82,79.38 JP1.4
K_2
  Bottom 0.406: IC3.38 168.91,57.15 170.18,58.42 170.18,68.58 161.29,77.47 153.67,77.47 151.76,79.38 87,79.38 86.36,78.74 JP1.5
K_3
  Bottom 0.406: IC3.39 168.28,59.69 169.54,60.96 169.54,68.26 160.97,76.83 160.34,76.83 160.02,76.83 153.35,76.83 151.45,78.74 89.22,78.74 88.9,78.42 JP1.6
K_4
  Bottom 0.406: JP1.7 91.44,76.2 93.34,74.3 150.18,74.3 152.4,72.07 IC3.1
K_5
  Bottom 0.406: IC3.24 166.37,21.59 157.48,30.48 157.48,69.22 151.76,74.93 95.25,74.93 93.98,76.2 JP1.8
K_6
  Bottom 0.406: IC3.25 166.37,24.13 158.12,32.38 158.12,69.53 152.08,75.56 97.16,75.56 96.52,76.2 JP1.9
K_7
  Bottom 0.406: IC3.26 166.69,26.67 158.75,34.61 158.75,40.93 158.72,40.96 158.72,69.88 151.45,77.15 JP1.10
LCD_D0
  Bottom 0.406: JP2.3 45.72,84.45 47.62,86.36 162.88,86.36 176.53,72.71 176.53,40.96 169.86,34.29 IC3.29
LCD_D1
  Bottom 0.406: JP2.4 48.26,83.19 50.8,85.72 162.56,85.72 175.9,72.39 175.9,42.86 169.86,36.83 IC3.30
LCD_D2
  Bottom 0.406: JP2.5 50.8,83.19 52.7,85.09 162.24,85.09 175.26,72.07 175.26,44.77 169.86,39.37 IC3.31
LCD_D3
  Bottom 0.406: 168.91,41.91 IC3.32 169.86,41.91 174.62,46.67 174.62,71.75 161.93,84.45 54.61,84.45 53.34,83.19 JP2.6
LCD_D4
  Bottom 0.406: JP2.7 55.88,82.55 57.15,83.82 161.61,83.82 173.99,71.44 173.99,48.58 169.86,44.45 IC3.33
LCD_D5
  Bottom 0.406: 168.28,46.99 IC3.34 169.86,46.99 173.35,50.48 173.35,71.12 161.29,83.19 59.37,83.19 58.42,82.23 JP2.8
LCD_D6
  Bottom 0.406: IC3.35 169.54,49.53 172.72,52.7 172.72,70.8 160.97,82.55 62.23,82.55 60.96,81.28 JP2.9
LCD_D7
  Bottom 0.406: JP2.10 63.5,81.28 64.14,81.92 160.66,81.92 172.09,70.48 172.09,54.93 168.91,51.75 167.96,51.75 IC3.36
LCD_EN
  Bottom 0.406: JP2.2 43.18,84.45 45.72,87 163.19,87 177.16,73.03 177.16,27.3 168.91,19.05 IC3.23
LCD_RS
  Bottom 0.406: JP2.1 40.64,84.45 43.81,87.63 163.51,87.63 177.8,73.34 177.8,25.4 168.91,16.51 IC3.22
MEMR*  (via drill 0.8 pad 1.93)
  Top 0.406: v139.06,24.77 v139.06,33.02 | v80.64,10.16 v80.64,47.31
  Bottom 0.406: v139.06,33.02 IC7.22 | 95.57,9.21 81.6,9.21 v80.64,10.16 | 95.57,9.21 132.72,9.21 134.62,11.11 136.53,11.11 137.16,11.75 137.16,22.86 v139.06,24.77 | U1.17 97.47,21.59 96.2,20.32 96.2,9.84 95.57,9.21 | v80.64,47.31 80.64,48.26 79.38,49.53 70.8,49.53 69.53,50.8 V1.11
MEMW*  (via drill 0.8 pad 1.93)
  Top 0.406: v78.11,47.31 v78.11,10.16
  Bottom 0.406: V1.13 65.72,52.7 65.72,50.48 67.31,48.9 77.47,48.9 78.11,48.26 v78.11,47.31 | v78.11,10.16 78.11,11.43 79.06,12.38 80.96,12.38 83.5,9.84 90.17,9.84 94.93,14.61 94.93,22.23 95.57,22.86 100.33,22.86 100.97,22.23 100.97,17.78 99.69,16.51 U1.15
N$1
  Bottom 0.406: LED1.A 9.21,7.3 16.19,14.29 R3.1
N$3
  Bottom 0.406: JP1.1 73.34,74.3 73.34,63.5 74.61,62.23 79.06,62.23 82.55,65.72 119.7,65.72 120.97,66.99 149.54,66.99 150.5,66.04 150.5,59.05 151.13,58.42 153.67,58.42 154.31,59.05 155.57,59.05 156.87,57.76 156.87,30.23 164.78,22.32 164.78,13.97 168.91,9.84 T1.C
N$4
  Bottom 0.406: R4.1 165.42,9.21 166.37,8.26 T1.B
N$6  (via drill 3.17 pad 3.81)
  other vias: 3.49,85.41
N$9  (via drill 3.17 pad 3.81)
  other vias: 175.58,85.41
N$10
  Bottom 0.406: R15.2 22.54,69.85 23.11,70.42 23.13,71.11 23.13,72.66 LED2.K
N$11  (via drill 3.17 pad 3.81)
  other vias: 175.58,3.49
N$12  (via drill 3.17 pad 3.81)
  other vias: 3.49,3.49
N$13  (via drill 3.17 pad 3.81)
  other vias: 18.73,85.41
N$14  (via drill 3.17 pad 3.81)
  other vias: 18.73,3.49
RD*
  Bottom 0.406: 151.13,41.91 IC3.9 150.18,41.91 148.91,43.18 148.91,53.34 138.43,63.82 122.56,63.82 115.89,57.15 52.07,57.15 50.16,55.24 50.16,51.12 53.02,48.26 58.74,48.26 59.37,47.62 V1.2 59.37,44.45 57.47,42.55 45.72,42.55 41.59,38.42 U$3.12 | IC1.32 U$3.12 | U$3.12 41.59,38.1
READY
  Bottom 0.406: IC1.35 U$3.15 33.97,38.73 32.07,40.64 28.89,40.64 25.4,44.13 R5.2 25.4,50.8
RESET_IN
  Top 0.406: S1.3 S1.4
  Bottom 0.406: IC1.36 U$3.16 31.43,38.1 30.16,39.37 28.26,39.37 22.23,45.4 R1.1 22.23,67.94 21.59,68.58 17.78,68.58 16.51,67.31 16.51,54.93 12.7,51.12 6.67,51.12 4.5,48.95 S1.4 | C8.+ 4.5,62.28 S1.3 4.5,60.42 C4.1
RESET_OUT  (via drill 0.8 pad 1.93)
  Top 0.406: v33.02,4.13 v37.47,4.13
  Bottom 0.406: IC3.4 156.21,50.8 156.21,29.21 160.02,25.4 160.02,8.89 155.89,4.76 58.74,4.76 57.78,4.13 v37.47,4.13 | IC1.3 U$2.3 26.35,5.71 27.94,4.13 v33.02,4.13
RST5_5
  Bottom 0.406: R13.1 U$2.9 IC1.9
RST6_5
  Bottom 0.406: IC1.8 U$2.8 R6.2
RST7_5
  Top 0.406: S3.1 S3.2
  Bottom 0.406: R11.2 U$2.7 IC1.7 36.51,25.72 35.56,26.67 12.06,26.67 9.47,29.26 S3.2 9.47,31.85 C16.1 8.41,33.18
S0
  Bottom 0.406: IC1.29 U$3.9
S1
  Bottom 0.406: IC1.33 U$3.13
SID
  Top 0.406: S2.3 S2.4
  Bottom 0.406: R2.1 U$2.5 IC1.5 31.43,22.54 28.68,25.3 S2.4 9.47,24.03 C5.1
SOD
  Bottom 0.406: 28.89,18.1 U$2.4 IC1.4 28.89,20.32 27.62,21.59 20.32,21.59 17.78,19.05 17.78,13.97 11.75,7.94 LED1.K
TRAP
  Bottom 0.406: R16.2 U$2.6 IC1.6
VCC
  Bottom 0.406: U$1.VBUS 8.53,72.43 8.26,72.71 4.76,72.71 4.13,73.34 4.13,74.93 5.84,76.64 5.84,78.99 6.99,80.01 27.62,80.01 32.7,74.93 65.09,74.93 66.04,75.88 JP2.11
WR*
  Bottom 0.406: 151.13,39.37 IC3.10 150.18,39.37 148.27,41.27 148.27,53.02 138.11,63.18 122.87,63.18 116.2,56.52 52.39,56.52 50.8,54.93 50.8,51.44 53.02,49.21 60.64,49.21 61.91,47.94 V1.3 61.91,44.13 59.69,41.91 46.04,41.91 44.13,40.01 U$3.11 IC1.31
X1
  Bottom 0.406: IC1.1 U$2.1 21.27,12.7 20.13,11.56 Q1.2 19.81,10.4 C9.2
X2
  Bottom 0.406: IC1.2 U$2.2 23.81,12.57 Q1.1 24.64,10.4 C2.2